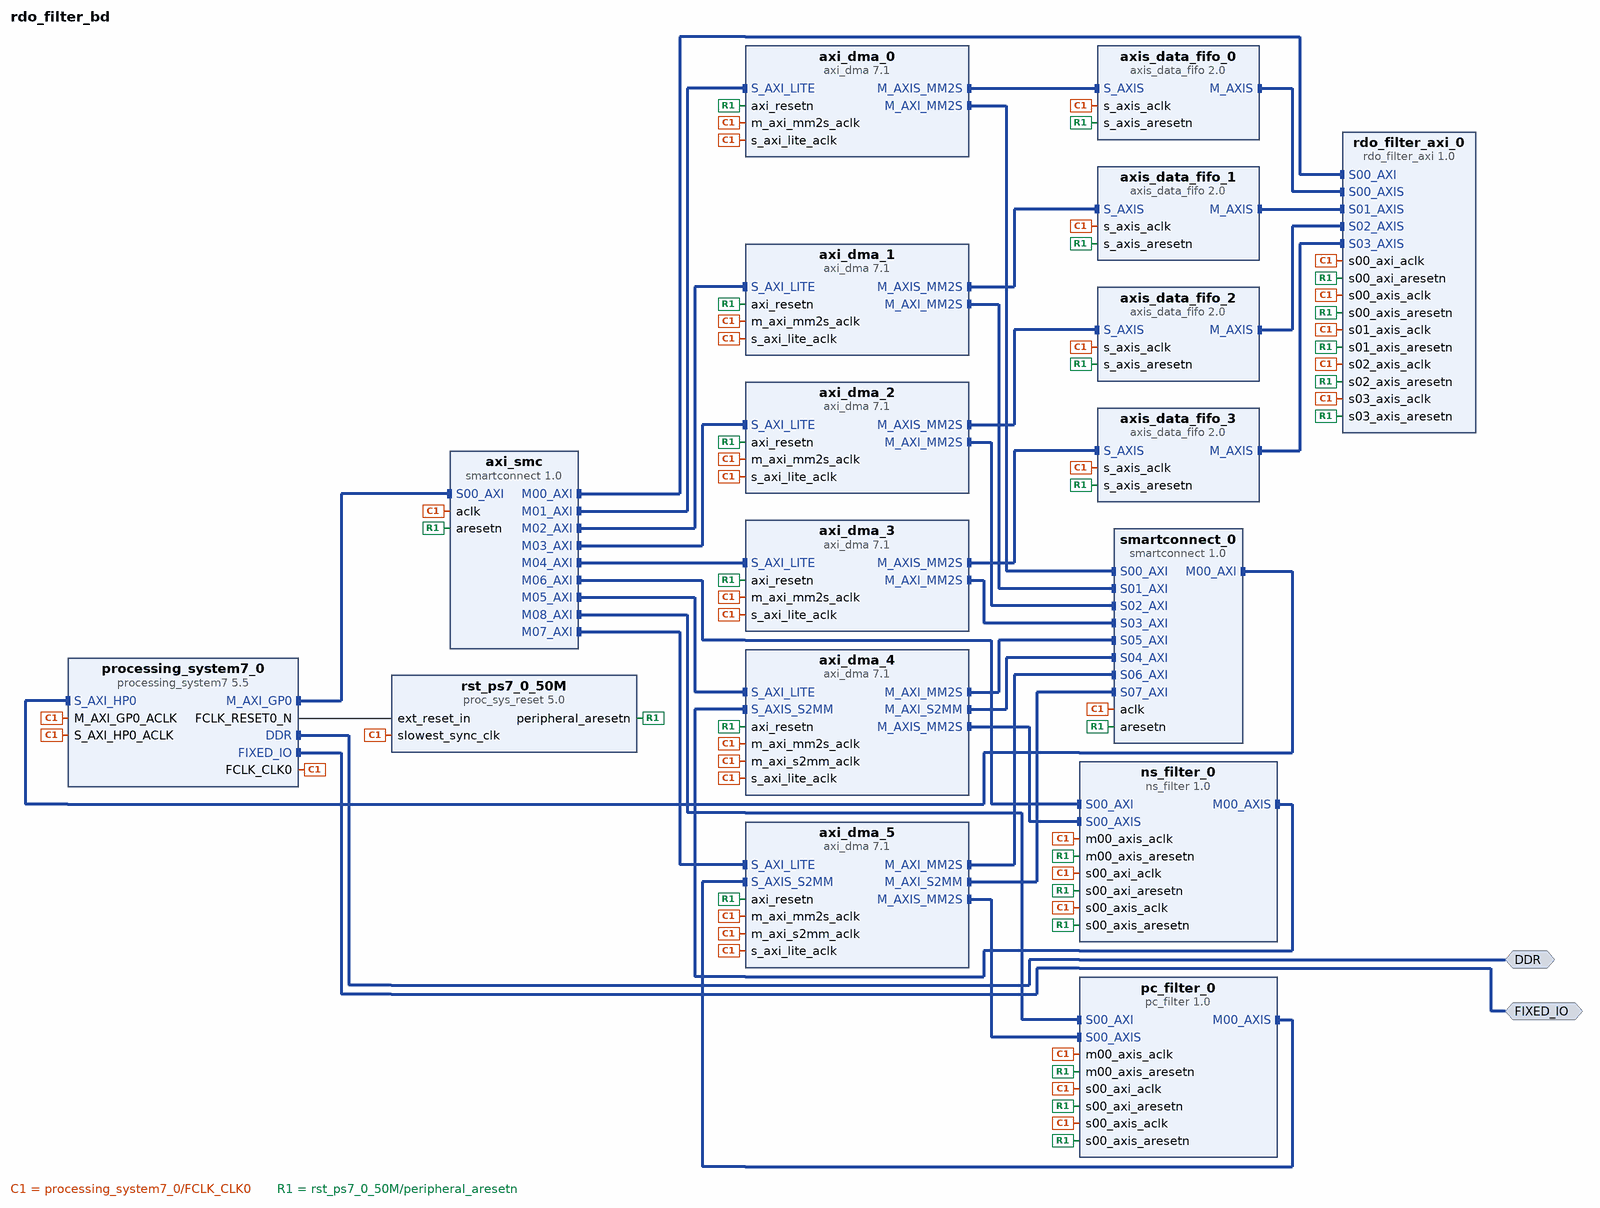
[diagram p0: block diagram of the top level]
# Vivado block design rdo_filter_bd, xc7z020clg400-1, Vivado 2025.2
create_bd_design rdo_filter_bd

create_bd_intf_port -mode Master -vlnv xilinx.com:interface:ddrx_rtl:1.0 DDR
create_bd_intf_port -mode Master -vlnv xilinx.com:display_processing_system7:fixedio_rtl:1.0 FIXED_IO

create_bd_cell -type ip -vlnv xilinx.com:user:rdo_filter_axi:1.0 rdo_filter_axi_0
create_bd_cell -type ip -vlnv xilinx.com:ip:axis_data_fifo:2.0 axis_data_fifo_0
set_property -dict {CONFIG.FIFO_DEPTH 16 CONFIG.TDATA_NUM_BYTES 4} [get_bd_cells axis_data_fifo_0]
create_bd_cell -type ip -vlnv xilinx.com:ip:axis_data_fifo:2.0 axis_data_fifo_1
set_property -dict {CONFIG.FIFO_DEPTH 16 CONFIG.TDATA_NUM_BYTES 4} [get_bd_cells axis_data_fifo_1]
create_bd_cell -type ip -vlnv xilinx.com:ip:axis_data_fifo:2.0 axis_data_fifo_2
set_property -dict {CONFIG.FIFO_DEPTH 16 CONFIG.TDATA_NUM_BYTES 4} [get_bd_cells axis_data_fifo_2]
create_bd_cell -type ip -vlnv xilinx.com:ip:axis_data_fifo:2.0 axis_data_fifo_3
set_property -dict {CONFIG.FIFO_DEPTH 16 CONFIG.TDATA_NUM_BYTES 4} [get_bd_cells axis_data_fifo_3]
create_bd_cell -type ip -vlnv xilinx.com:ip:processing_system7:5.5 processing_system7_0
set_property -dict {CONFIG.PCW_FPGA0_PERIPHERAL_FREQMHZ 100 CONFIG.PCW_USE_S_AXI_HP0 1} [get_bd_cells processing_system7_0]
# 30 more settings of processing_system7_0 are not shown: defaults, MIO pin electricals, DDR timing, and values the tool derives
create_bd_cell -type ip -vlnv xilinx.com:ip:smartconnect:1.0 axi_smc
set_property -dict {CONFIG.NUM_MI 9 CONFIG.NUM_SI 1} [get_bd_cells axi_smc]
create_bd_cell -type ip -vlnv xilinx.com:ip:proc_sys_reset:5.0 rst_ps7_0_50M
create_bd_cell -type ip -vlnv xilinx.com:ip:axi_dma:7.1 axi_dma_0
set_property -dict {CONFIG.c_include_s2mm 0 CONFIG.c_include_sg 0 CONFIG.c_sg_length_width 20} [get_bd_cells axi_dma_0]
create_bd_cell -type ip -vlnv xilinx.com:ip:axi_dma:7.1 axi_dma_1
set_property -dict {CONFIG.c_include_s2mm 0 CONFIG.c_include_sg 0 CONFIG.c_sg_length_width 20} [get_bd_cells axi_dma_1]
create_bd_cell -type ip -vlnv xilinx.com:ip:axi_dma:7.1 axi_dma_2
set_property -dict {CONFIG.c_include_s2mm 0 CONFIG.c_include_sg 0 CONFIG.c_sg_length_width 20} [get_bd_cells axi_dma_2]
create_bd_cell -type ip -vlnv xilinx.com:ip:axi_dma:7.1 axi_dma_3
set_property -dict {CONFIG.c_include_s2mm 0 CONFIG.c_include_sg 0 CONFIG.c_sg_length_width 20} [get_bd_cells axi_dma_3]
create_bd_cell -type ip -vlnv xilinx.com:ip:smartconnect:1.0 smartconnect_0
set_property -dict {CONFIG.NUM_SI 8} [get_bd_cells smartconnect_0]
create_bd_cell -type ip -vlnv xilinx.com:ip:axi_dma:7.1 axi_dma_4
set_property -dict {CONFIG.c_include_sg 0 CONFIG.c_sg_length_width 23} [get_bd_cells axi_dma_4]
create_bd_cell -type ip -vlnv Psukirti:user:ns_filter:1.0 ns_filter_0
create_bd_cell -type ip -vlnv Psukirti:user:pc_filter:1.0 pc_filter_0
create_bd_cell -type ip -vlnv xilinx.com:ip:axi_dma:7.1 axi_dma_5
set_property -dict {CONFIG.c_include_sg 0 CONFIG.c_sg_length_width 23} [get_bd_cells axi_dma_5]

# ---- connections ----

connect_bd_intf_net [get_bd_intf_pins axi_dma_0/M_AXIS_MM2S] [get_bd_intf_pins axis_data_fifo_0/S_AXIS]
connect_bd_intf_net [get_bd_intf_pins axi_dma_0/M_AXI_MM2S] [get_bd_intf_pins smartconnect_0/S00_AXI]
connect_bd_intf_net [get_bd_intf_pins axi_dma_1/M_AXIS_MM2S] [get_bd_intf_pins axis_data_fifo_1/S_AXIS]
connect_bd_intf_net [get_bd_intf_pins axi_dma_1/M_AXI_MM2S] [get_bd_intf_pins smartconnect_0/S01_AXI]
connect_bd_intf_net [get_bd_intf_pins axi_dma_2/M_AXIS_MM2S] [get_bd_intf_pins axis_data_fifo_2/S_AXIS]
connect_bd_intf_net [get_bd_intf_pins axi_dma_2/M_AXI_MM2S] [get_bd_intf_pins smartconnect_0/S02_AXI]
connect_bd_intf_net [get_bd_intf_pins axi_dma_3/M_AXIS_MM2S] [get_bd_intf_pins axis_data_fifo_3/S_AXIS]
connect_bd_intf_net [get_bd_intf_pins axi_dma_3/M_AXI_MM2S] [get_bd_intf_pins smartconnect_0/S03_AXI]
connect_bd_intf_net [get_bd_intf_pins axi_dma_4/M_AXIS_MM2S] [get_bd_intf_pins ns_filter_0/S00_AXIS]
connect_bd_intf_net [get_bd_intf_pins smartconnect_0/S05_AXI] [get_bd_intf_pins axi_dma_4/M_AXI_MM2S]
connect_bd_intf_net [get_bd_intf_pins axi_dma_4/M_AXI_S2MM] [get_bd_intf_pins smartconnect_0/S04_AXI]
connect_bd_intf_net [get_bd_intf_pins axi_dma_5/M_AXIS_MM2S] [get_bd_intf_pins pc_filter_0/S00_AXIS]
connect_bd_intf_net [get_bd_intf_pins axi_dma_5/M_AXI_MM2S] [get_bd_intf_pins smartconnect_0/S06_AXI]
connect_bd_intf_net [get_bd_intf_pins axi_dma_5/M_AXI_S2MM] [get_bd_intf_pins smartconnect_0/S07_AXI]
connect_bd_intf_net [get_bd_intf_pins axi_smc/M00_AXI] [get_bd_intf_pins rdo_filter_axi_0/S00_AXI]
connect_bd_intf_net [get_bd_intf_pins axi_smc/M01_AXI] [get_bd_intf_pins axi_dma_0/S_AXI_LITE]
connect_bd_intf_net [get_bd_intf_pins axi_smc/M02_AXI] [get_bd_intf_pins axi_dma_1/S_AXI_LITE]
connect_bd_intf_net [get_bd_intf_pins axi_smc/M03_AXI] [get_bd_intf_pins axi_dma_2/S_AXI_LITE]
connect_bd_intf_net [get_bd_intf_pins axi_smc/M04_AXI] [get_bd_intf_pins axi_dma_3/S_AXI_LITE]
connect_bd_intf_net [get_bd_intf_pins axi_smc/M05_AXI] [get_bd_intf_pins axi_dma_4/S_AXI_LITE]
connect_bd_intf_net [get_bd_intf_pins axi_smc/M06_AXI] [get_bd_intf_pins ns_filter_0/S00_AXI]
connect_bd_intf_net [get_bd_intf_pins axi_smc/M07_AXI] [get_bd_intf_pins axi_dma_5/S_AXI_LITE]
connect_bd_intf_net [get_bd_intf_pins axi_smc/M08_AXI] [get_bd_intf_pins pc_filter_0/S00_AXI]
connect_bd_intf_net [get_bd_intf_pins axis_data_fifo_0/M_AXIS] [get_bd_intf_pins rdo_filter_axi_0/S00_AXIS]
connect_bd_intf_net [get_bd_intf_pins axis_data_fifo_1/M_AXIS] [get_bd_intf_pins rdo_filter_axi_0/S01_AXIS]
connect_bd_intf_net [get_bd_intf_pins axis_data_fifo_2/M_AXIS] [get_bd_intf_pins rdo_filter_axi_0/S02_AXIS]
connect_bd_intf_net [get_bd_intf_pins axis_data_fifo_3/M_AXIS] [get_bd_intf_pins rdo_filter_axi_0/S03_AXIS]
connect_bd_intf_net [get_bd_intf_pins ns_filter_0/M00_AXIS] [get_bd_intf_pins axi_dma_4/S_AXIS_S2MM]
connect_bd_intf_net [get_bd_intf_pins pc_filter_0/M00_AXIS] [get_bd_intf_pins axi_dma_5/S_AXIS_S2MM]
connect_bd_intf_net [get_bd_intf_ports DDR] [get_bd_intf_pins processing_system7_0/DDR]
connect_bd_intf_net [get_bd_intf_ports FIXED_IO] [get_bd_intf_pins processing_system7_0/FIXED_IO]
connect_bd_intf_net [get_bd_intf_pins processing_system7_0/M_AXI_GP0] [get_bd_intf_pins axi_smc/S00_AXI]
connect_bd_intf_net [get_bd_intf_pins smartconnect_0/M00_AXI] [get_bd_intf_pins processing_system7_0/S_AXI_HP0]
connect_bd_net [get_bd_pins processing_system7_0/FCLK_CLK0] \
  [get_bd_pins processing_system7_0/M_AXI_GP0_ACLK] [get_bd_pins axi_smc/aclk] [get_bd_pins rdo_filter_axi_0/s00_axi_aclk] \
  [get_bd_pins rst_ps7_0_50M/slowest_sync_clk] [get_bd_pins rdo_filter_axi_0/s00_axis_aclk] \
  [get_bd_pins axis_data_fifo_0/s_axis_aclk] [get_bd_pins rdo_filter_axi_0/s01_axis_aclk] \
  [get_bd_pins axis_data_fifo_1/s_axis_aclk] [get_bd_pins rdo_filter_axi_0/s02_axis_aclk] \
  [get_bd_pins axis_data_fifo_2/s_axis_aclk] [get_bd_pins rdo_filter_axi_0/s03_axis_aclk] \
  [get_bd_pins axis_data_fifo_3/s_axis_aclk] [get_bd_pins axi_dma_0/s_axi_lite_aclk] [get_bd_pins axi_dma_1/s_axi_lite_aclk] \
  [get_bd_pins axi_dma_2/s_axi_lite_aclk] [get_bd_pins axi_dma_3/s_axi_lite_aclk] [get_bd_pins axi_dma_0/m_axi_mm2s_aclk] \
  [get_bd_pins processing_system7_0/S_AXI_HP0_ACLK] [get_bd_pins axi_dma_1/m_axi_mm2s_aclk] \
  [get_bd_pins axi_dma_2/m_axi_mm2s_aclk] [get_bd_pins axi_dma_3/m_axi_mm2s_aclk] [get_bd_pins smartconnect_0/aclk] \
  [get_bd_pins axi_dma_4/m_axi_mm2s_aclk] [get_bd_pins axi_dma_4/m_axi_s2mm_aclk] [get_bd_pins axi_dma_4/s_axi_lite_aclk] \
  [get_bd_pins axi_dma_5/m_axi_mm2s_aclk] [get_bd_pins axi_dma_5/m_axi_s2mm_aclk] [get_bd_pins axi_dma_5/s_axi_lite_aclk] \
  [get_bd_pins pc_filter_0/s00_axi_aclk] [get_bd_pins pc_filter_0/s00_axis_aclk] [get_bd_pins pc_filter_0/m00_axis_aclk] \
  [get_bd_pins ns_filter_0/s00_axi_aclk] [get_bd_pins ns_filter_0/s00_axis_aclk] [get_bd_pins ns_filter_0/m00_axis_aclk]
connect_bd_net [get_bd_pins processing_system7_0/FCLK_RESET0_N] [get_bd_pins rst_ps7_0_50M/ext_reset_in]
connect_bd_net [get_bd_pins rst_ps7_0_50M/peripheral_aresetn] \
  [get_bd_pins rdo_filter_axi_0/s00_axi_aresetn] [get_bd_pins axi_smc/aresetn] \
  [get_bd_pins rdo_filter_axi_0/s00_axis_aresetn] [get_bd_pins axis_data_fifo_0/s_axis_aresetn] \
  [get_bd_pins rdo_filter_axi_0/s01_axis_aresetn] [get_bd_pins axis_data_fifo_1/s_axis_aresetn] \
  [get_bd_pins rdo_filter_axi_0/s02_axis_aresetn] [get_bd_pins axis_data_fifo_2/s_axis_aresetn] \
  [get_bd_pins rdo_filter_axi_0/s03_axis_aresetn] [get_bd_pins axis_data_fifo_3/s_axis_aresetn] \
  [get_bd_pins axi_dma_0/axi_resetn] [get_bd_pins axi_dma_1/axi_resetn] [get_bd_pins axi_dma_2/axi_resetn] \
  [get_bd_pins axi_dma_3/axi_resetn] [get_bd_pins smartconnect_0/aresetn] [get_bd_pins axi_dma_4/axi_resetn] \
  [get_bd_pins axi_dma_5/axi_resetn] [get_bd_pins pc_filter_0/s00_axi_aresetn] [get_bd_pins pc_filter_0/s00_axis_aresetn] \
  [get_bd_pins pc_filter_0/m00_axis_aresetn] [get_bd_pins ns_filter_0/s00_axi_aresetn] \
  [get_bd_pins ns_filter_0/s00_axis_aresetn] [get_bd_pins ns_filter_0/m00_axis_aresetn]

# ---- address map ----
assign_bd_address -offset 0x00000000 -range 512M -target_address_space [get_bd_addr_spaces axi_dma_0/Data_MM2S] [get_bd_addr_segs processing_system7_0/S_AXI_HP0/HP0_DDR_LOWOCM]
assign_bd_address -offset 0x00000000 -range 512M -target_address_space [get_bd_addr_spaces axi_dma_1/Data_MM2S] [get_bd_addr_segs processing_system7_0/S_AXI_HP0/HP0_DDR_LOWOCM]
assign_bd_address -offset 0x00000000 -range 512M -target_address_space [get_bd_addr_spaces axi_dma_2/Data_MM2S] [get_bd_addr_segs processing_system7_0/S_AXI_HP0/HP0_DDR_LOWOCM]
assign_bd_address -offset 0x00000000 -range 512M -target_address_space [get_bd_addr_spaces axi_dma_3/Data_MM2S] [get_bd_addr_segs processing_system7_0/S_AXI_HP0/HP0_DDR_LOWOCM]
assign_bd_address -offset 0x00000000 -range 512M -target_address_space [get_bd_addr_spaces axi_dma_4/Data_MM2S] [get_bd_addr_segs processing_system7_0/S_AXI_HP0/HP0_DDR_LOWOCM]
assign_bd_address -offset 0x00000000 -range 512M -target_address_space [get_bd_addr_spaces axi_dma_4/Data_S2MM] [get_bd_addr_segs processing_system7_0/S_AXI_HP0/HP0_DDR_LOWOCM]
assign_bd_address -offset 0x00000000 -range 512M -target_address_space [get_bd_addr_spaces axi_dma_5/Data_MM2S] [get_bd_addr_segs processing_system7_0/S_AXI_HP0/HP0_DDR_LOWOCM]
assign_bd_address -offset 0x00000000 -range 512M -target_address_space [get_bd_addr_spaces axi_dma_5/Data_S2MM] [get_bd_addr_segs processing_system7_0/S_AXI_HP0/HP0_DDR_LOWOCM]
assign_bd_address -offset 0x40400000 -range 64K -target_address_space [get_bd_addr_spaces processing_system7_0/Data] [get_bd_addr_segs axi_dma_0/S_AXI_LITE/Reg]
assign_bd_address -offset 0x40410000 -range 64K -target_address_space [get_bd_addr_spaces processing_system7_0/Data] [get_bd_addr_segs axi_dma_1/S_AXI_LITE/Reg]
assign_bd_address -offset 0x40420000 -range 64K -target_address_space [get_bd_addr_spaces processing_system7_0/Data] [get_bd_addr_segs axi_dma_2/S_AXI_LITE/Reg]
assign_bd_address -offset 0x40430000 -range 64K -target_address_space [get_bd_addr_spaces processing_system7_0/Data] [get_bd_addr_segs axi_dma_3/S_AXI_LITE/Reg]
assign_bd_address -offset 0x40440000 -range 64K -target_address_space [get_bd_addr_spaces processing_system7_0/Data] [get_bd_addr_segs axi_dma_4/S_AXI_LITE/Reg]
assign_bd_address -offset 0x40450000 -range 64K -target_address_space [get_bd_addr_spaces processing_system7_0/Data] [get_bd_addr_segs axi_dma_5/S_AXI_LITE/Reg]
assign_bd_address -offset 0x43C00000 -range 64K -target_address_space [get_bd_addr_spaces processing_system7_0/Data] [get_bd_addr_segs rdo_filter_axi_0/S00_AXI/S00_AXI_reg]
assign_bd_address -offset 0x43C10000 -range 64K -target_address_space [get_bd_addr_spaces processing_system7_0/Data] [get_bd_addr_segs ns_filter_0/S00_AXI/S00_AXI_reg]
assign_bd_address -offset 0x43C20000 -range 64K -target_address_space [get_bd_addr_spaces processing_system7_0/Data] [get_bd_addr_segs pc_filter_0/S00_AXI/S00_AXI_reg]

validate_bd_design
save_bd_design
